# EAGLE design netuno (EAGLE 7.3.0)
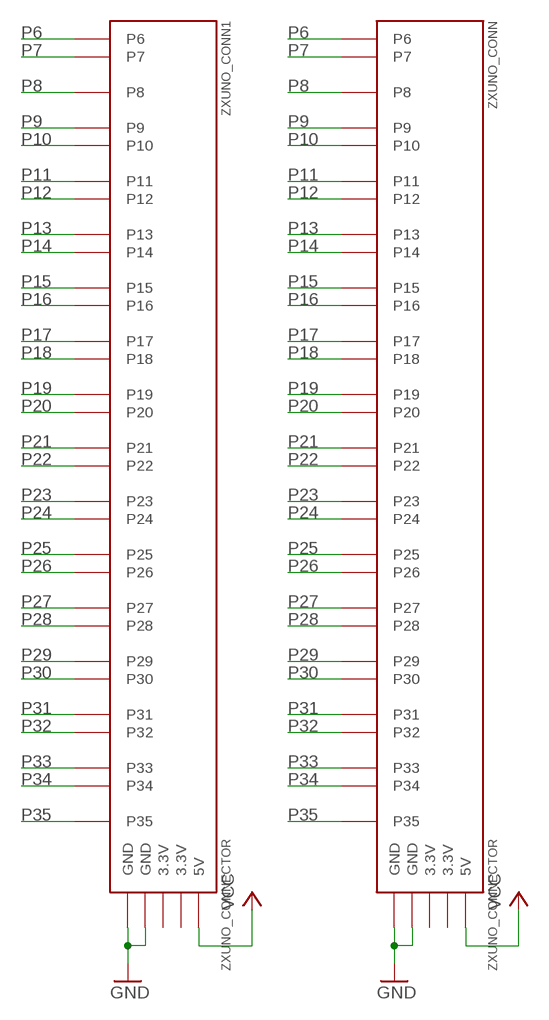
[diagram p0: schematic, sheet 1]

## Parts
ZXUNO_CONN  ZXUNO_CONNECTOR  [ZXUNO_CONNECTOR]
ZXUNO_CONN1  ZXUNO_CONNECTOR  [ZXUNO_CONNECTOR]

## Nets
GND: ZXUNO_CONN1.GND@1(GND) ZXUNO_CONN1.GND@2(GND) ZXUNO_CONN.GND@1(GND) ZXUNO_CONN.GND@2(GND)
P6: ZXUNO_CONN1.P6 ZXUNO_CONN.P6
P7: ZXUNO_CONN1.P7 ZXUNO_CONN.P7
P8: ZXUNO_CONN1.P8 ZXUNO_CONN.P8
P9: ZXUNO_CONN1.P9 ZXUNO_CONN.P9
P10: ZXUNO_CONN1.P10 ZXUNO_CONN.P10
P11: ZXUNO_CONN1.P11 ZXUNO_CONN.P11
P12: ZXUNO_CONN1.P12 ZXUNO_CONN.P12
P13: ZXUNO_CONN1.P13 ZXUNO_CONN.P13
P14: ZXUNO_CONN1.P14 ZXUNO_CONN.P14
P15: ZXUNO_CONN1.P15 ZXUNO_CONN.P15
P16: ZXUNO_CONN1.P16 ZXUNO_CONN.P16
P17: ZXUNO_CONN1.P17 ZXUNO_CONN.P17
P18: ZXUNO_CONN1.P18 ZXUNO_CONN.P18
P19: ZXUNO_CONN1.P19 ZXUNO_CONN.P19
P20: ZXUNO_CONN1.P20 ZXUNO_CONN.P20
P21: ZXUNO_CONN1.P21 ZXUNO_CONN.P21
P22: ZXUNO_CONN1.P22 ZXUNO_CONN.P22
P23: ZXUNO_CONN1.P23 ZXUNO_CONN.P23
P24: ZXUNO_CONN1.P24 ZXUNO_CONN.P24
P25: ZXUNO_CONN1.P25 ZXUNO_CONN.P25
P26: ZXUNO_CONN1.P26 ZXUNO_CONN.P26
P27: ZXUNO_CONN1.P27 ZXUNO_CONN.P27
P28: ZXUNO_CONN1.P28 ZXUNO_CONN.P28
P29: ZXUNO_CONN1.P29 ZXUNO_CONN.P29
P30: ZXUNO_CONN1.P30 ZXUNO_CONN.P30
P31: ZXUNO_CONN1.P31 ZXUNO_CONN.P31
P32: ZXUNO_CONN1.P32 ZXUNO_CONN.P32
P33: ZXUNO_CONN1.P33 ZXUNO_CONN.P33
P34: ZXUNO_CONN1.P34 ZXUNO_CONN.P34
P35: ZXUNO_CONN1.P35 ZXUNO_CONN.P35
VCC: ZXUNO_CONN1.5V ZXUNO_CONN.5V

## Power pins joined to a net without a drawn wire
3.3V: ZXUNO_CONN1.3.3V@1(3.3V) ZXUNO_CONN1.3.3V@2(3.3V) ZXUNO_CONN.3.3V@1(3.3V) ZXUNO_CONN.3.3V@2(3.3V)

## Library data of the parts
ZXUNO_CONN ZXUNO_CONN1 = zxuno:ZXUNO_CONNECTOR

## Net classes
0 default: width 0.178 mm, clearance 0.178 mm
1 power: width 0.305 mm, clearance 0.178 mm to class 0, clearance 0.229 mm

## Board
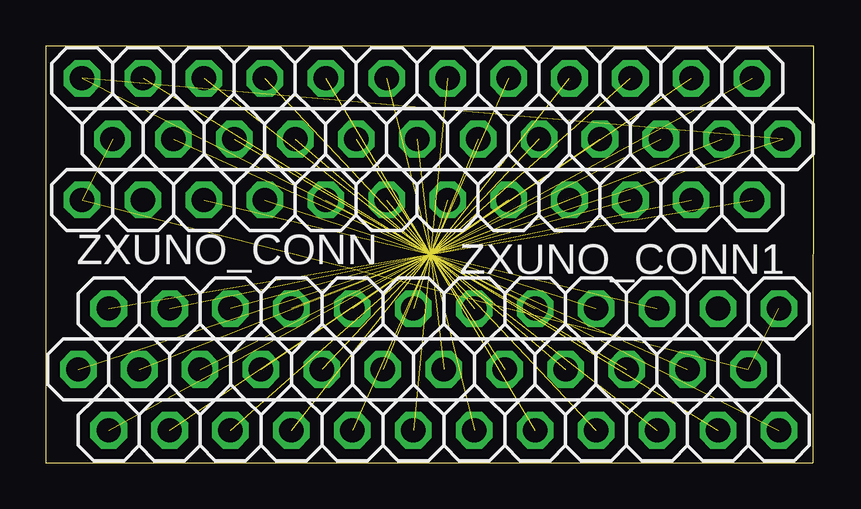
[diagram p1: board, top side]
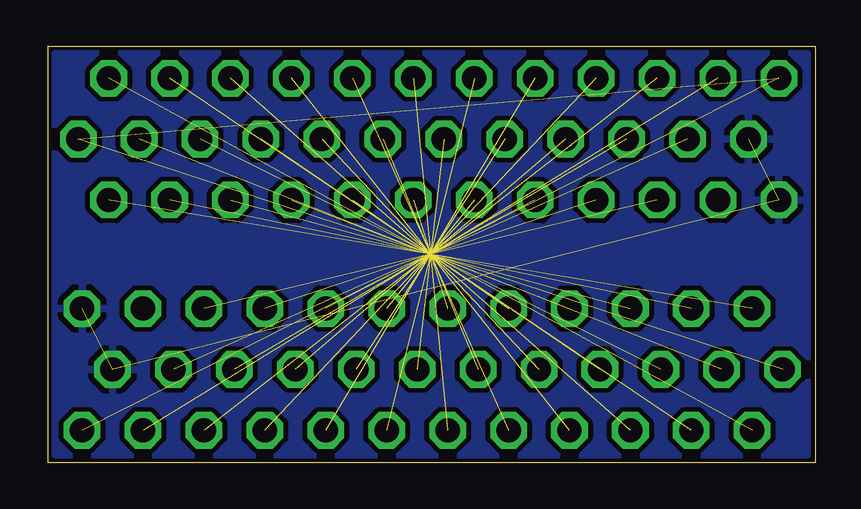
[diagram p2: board, bottom side, seen from below]

No outline drawn. Coordinates in mm, seen from the top.
Copper layers (1*16): Top 0.035mm / dielectric 1.5mm / Bottom 0.035mm
Design rules "default": minimum track width 10mil, minimum drill 24mil, track to track 8mil, track to pad 8mil, pad to pad 8mil, via to via 8mil, smd to smd 8mil, copper to edge 40mil, drill to drill 8mil, minimum pad ring 10mil, minimum via ring 8mil, stop-mask expansion 4mil, vias tented up to drill 0mil, thermal gap 10mil
Milling: 4 lines

### Footprints (pad centres in the part's own frame; a part is rotated, then mirrored left to right if it is on the bottom)
ZXUNO_CONNECTOR = drill 1.016 octagon: 3.3V@1 -13.97,0; 3.3V@2 15.24,-2.54; 5V -12.7,-2.54; GND@1 15.24,2.54; GND@2 13.97,0; NC@1 12.7,2.54; P6 -12.7,2.54; P7 -10.16,-2.54; P8 -11.43,0; P9 -10.16,2.54; P10 -7.62,-2.54; P11 -8.89,0; P12 -7.62,2.54; P13 -5.08,-2.54; P14 -6.35,0; P15 -5.08,2.54; P16 -2.54,-2.54; P17 -3.81,0; P18 -2.54,2.54; P19 0,-2.54; P20 -1.27,0; P21 0,2.54; P22 2.54,-2.54; P23 1.27,0; P24 2.54,2.54; P25 5.08,-2.54; P26 3.81,0; P27 5.08,2.54; P28 7.62,-2.54; P29 6.35,0; P30 7.62,2.54; P31 10.16,-2.54; P32 8.89,0; P33 10.16,2.54; P34 12.7,-2.54; P35 11.43,0

### Placement (x,y rotation side)
ZXUNO_CONN  15.32,3.89 0 top
ZXUNO_CONN1  16.75,13.49 180 top

### Tracks (layer width: path | path; a pad name or v marks a point on that pad's centre or on a via)
3.3V  (3 unrouted)
GND  (3 unrouted)
  pour Bottom: 0.32,17.07 31.67,17.07 31.67,0.32 0.32,0.32
P6  (1 unrouted)
P7  (1 unrouted)
P8  (1 unrouted)
P9  (1 unrouted)
P10  (1 unrouted)
P11  (1 unrouted)
P12  (1 unrouted)
P13  (1 unrouted)
P14  (1 unrouted)
P15  (1 unrouted)
P16  (1 unrouted)
P17  (1 unrouted)
P18  (1 unrouted)
P19  (1 unrouted)
P20  (1 unrouted)
P21  (1 unrouted)
P22  (1 unrouted)
P23  (1 unrouted)
P24  (1 unrouted)
P25  (1 unrouted)
P26  (1 unrouted)
P27  (1 unrouted)
P28  (1 unrouted)
P29  (1 unrouted)
P30  (1 unrouted)
P31  (1 unrouted)
P32  (1 unrouted)
P33  (1 unrouted)
P34  (1 unrouted)
P35  (1 unrouted)
VCC  (1 unrouted)